# Altium schematic sheet power_CTL.schdoc: power_CTL.schdoc
size A4; DrawnBy: Ryan Castle; Engineer: Ryan Castle; Organization: Badgerloop; Address1: 133 Engineering Research; Address2: Building; Address3: Madison, WI 53715; DocumentNumber: 1; Revision: A; SheetNumber: 1; SheetTotal: 2
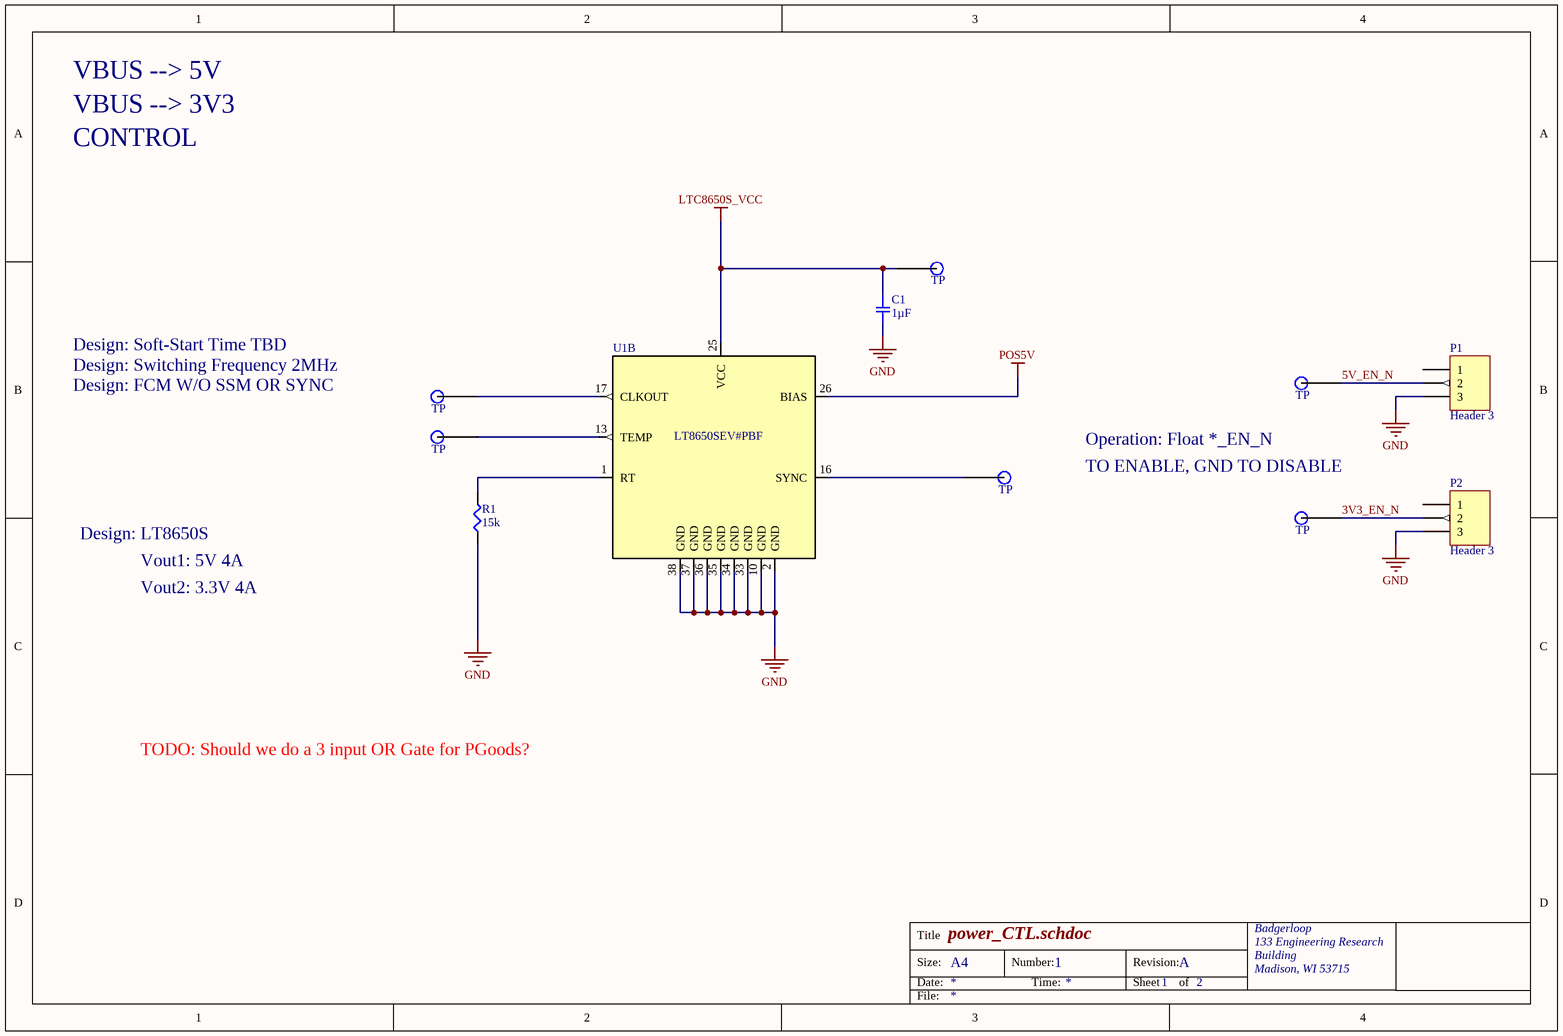
[diagram p0: power_CTL.schdoc]

## Parts
C1  1µF  [SMD-0603C]
P1  Header 3  [Pin Header 1x3 TH Pitch 2.54mm]
P2  Header 3  [Pin Header 1x3 TH Pitch 2.54mm]
R1  15k  [SMD-0402-RES]
TP1  TP  [Test Point]
TP2  TP  [Test Point]
TP3  TP  [Test Point]
TP4  TP  [Test Point]
TP5  TP  [Test Point]
TP6  TP  [Test Point]
U1  LT8650SEV#PBF  [QFN50P600X400X103-32N240X440]  (part B of 2)

## Nets
GND: C1.2 P1.3 P2.3 R1.1 U1.2(GND) U1.10(GND) U1.33(GND) U1.34(GND) U1.35(GND) U1.36(GND) U1.37(GND) U1.38(GND)
LTC8650S_VCC: C1.1 TP1.1 U1.25(VCC)
POS5V: U1.26(BIAS)
3V3_EN_N: P2.2 TP6.1
5V_EN_N: P1.2 TP2.1
NetR1_2: R1.2 U1.1(RT)
NetTP3_1: TP3.1 U1.17(CLKOUT)
NetTP4_1: TP4.1 U1.13(TEMP)
NetTP5_1: TP5.1 U1.16(SYNC)

Not connected (* = marked no-connect by the designer): P1 1; P2 1

## Notes on the sheet
- VBUS --> 5V
- VBUS --> 3V3
- CONTROL
- Design: Soft-Start Time TBD
- Design: Switching Frequency 2MHz
- Design: FCM W/O SSM OR SYNC
- Operation: Float *_EN_N
- (near TP6) TO ENABLE, GND TO DISABLE
- Design: LT8650S
- Vout1: 5V 4A
- Vout2: 3.3V 4A
- TODO: Should we do a 3 input OR Gate for PGoods?
- Title
- Size:
- Date:
- A4
- Number:
- Time:
- Revision:
- Sheet
- of
- File:

## Library data of the parts
C1 = GRM188R61H105KAALD: CAP CER 1UF 50V X5R 0603; Manufacturer: Murata Electronics North America; Factory Stock: 0; Unit Price (USD): 0.17; Minimum Quantity: 1; Tolerance: ±10%; Datasheets: http://www.murata.com/~/media/webrenewal/support/library/catalog/products/capacitor/mlcc/c02e.pdf; Image: //media.digikey.com/Renders/Murata%20Renders/ZRB-SERIES-0402.jpg; Digi-Key Part Number: 490-10732-1-ND; Part Number: GRM188R61H105KAALD; Quantity Available: 46576; @ qty: 0; Packaging: Cut Tape (CT); Series: GRM; Part Status: Active; Value: 1µF; Voltage: 50V; Temperature Coefficient: X5R; Operating Temperature: -55°C ~ 85°C; Features: -; Ratings: -; Applications: General Purpose; Mounting Type: Surface Mount, MLCC; Package / Case: 0603 (1608 Metric); Size / Dimension: 0.063" L x 0.031" W (1.60mm x 0.80mm); Height - Seated (Max): -; Thickness (Max): 0.035" (0.90mm); Lead Spacing: -; Lead Style: -
P1 P2 = Header 3: Header, 3-Pin; LatestRevisionDate: 17-Jul-2002; LatestRevisionNote: Re-released for DXP Platform.; Publisher: Altium Limited
R1 = ERJ-2GEJ153X: RES SMD 15K OHM 5% 1/10W 0402; Manufacturer: Panasonic Electronic Components; Factory Stock: 0; Unit Price (USD): 0.00350; @ qty: 1500; Minimum Quantity: 1; Power (Watts): 0.1W, 1/10W; Temperature Coefficient: ±200ppm/°C; Part Number: ERJ-2GEJ153X; Datasheets: http://industrial.panasonic.com/www-cgi/jvcr13pz.cgi?E+PZ+3+AOA0001+ERJ2GEJ153X+7+WW; Image: //media.digikey.com/Photos/Panasonic%20Photos/ERJ-PA2-Series.jpg; Digi-Key Part Number: P15KJCT-ND; Quantity Available: 331812; Packaging: Cut Tape (CT); Series: ERJ; Part Status: Active; Value: 15k; Tolerance: ±5%; Composition: Thick Film; Features: Automotive AEC-Q200; Operating Temperature: -55°C ~ 155°C; Package / Case: 0402 (1005 Metric); Supplier Device Package: 0402; Size / Dimension: 0.039" L x 0.020" W (1.00mm x 0.50mm); Height - Seated (Max): 0.016" (0.40mm); Number of Terminations: 2; Failure Rate: -
U1 = LT8650SEV#PBF: LT8650S - Dual Channel 4A, 42V, Synchronous Step-Down Silent Switcher 2 with 6.2ÂµA Quiescent Current; MF: Linear Technology; MP: LT8650SEV#PBF; SnapEDA_Link: https://www.snapeda.com/parts/LT8650SEV%23PBF/Linear%20Technology/Analog%20Devices/view-part/?ref=snap; Digi-Key_Part_Number: LT8650SEV#PBF-ND; Package: LQFN-32 Linear Technology; Digi-Key_Purchase_URL: https://www.digikey.com/product-detail/en/linear-technology-analog-devices/LT8650SEV-PBF/LT8650SEV-PBF-ND/7702365?utm_source=snapeda&utm_medium=aggregator&utm_campaign=symbol; Value: *